# EAGLE schematic cyclops_r2b (EAGLE 6.4)

## Sheet 1 of 3
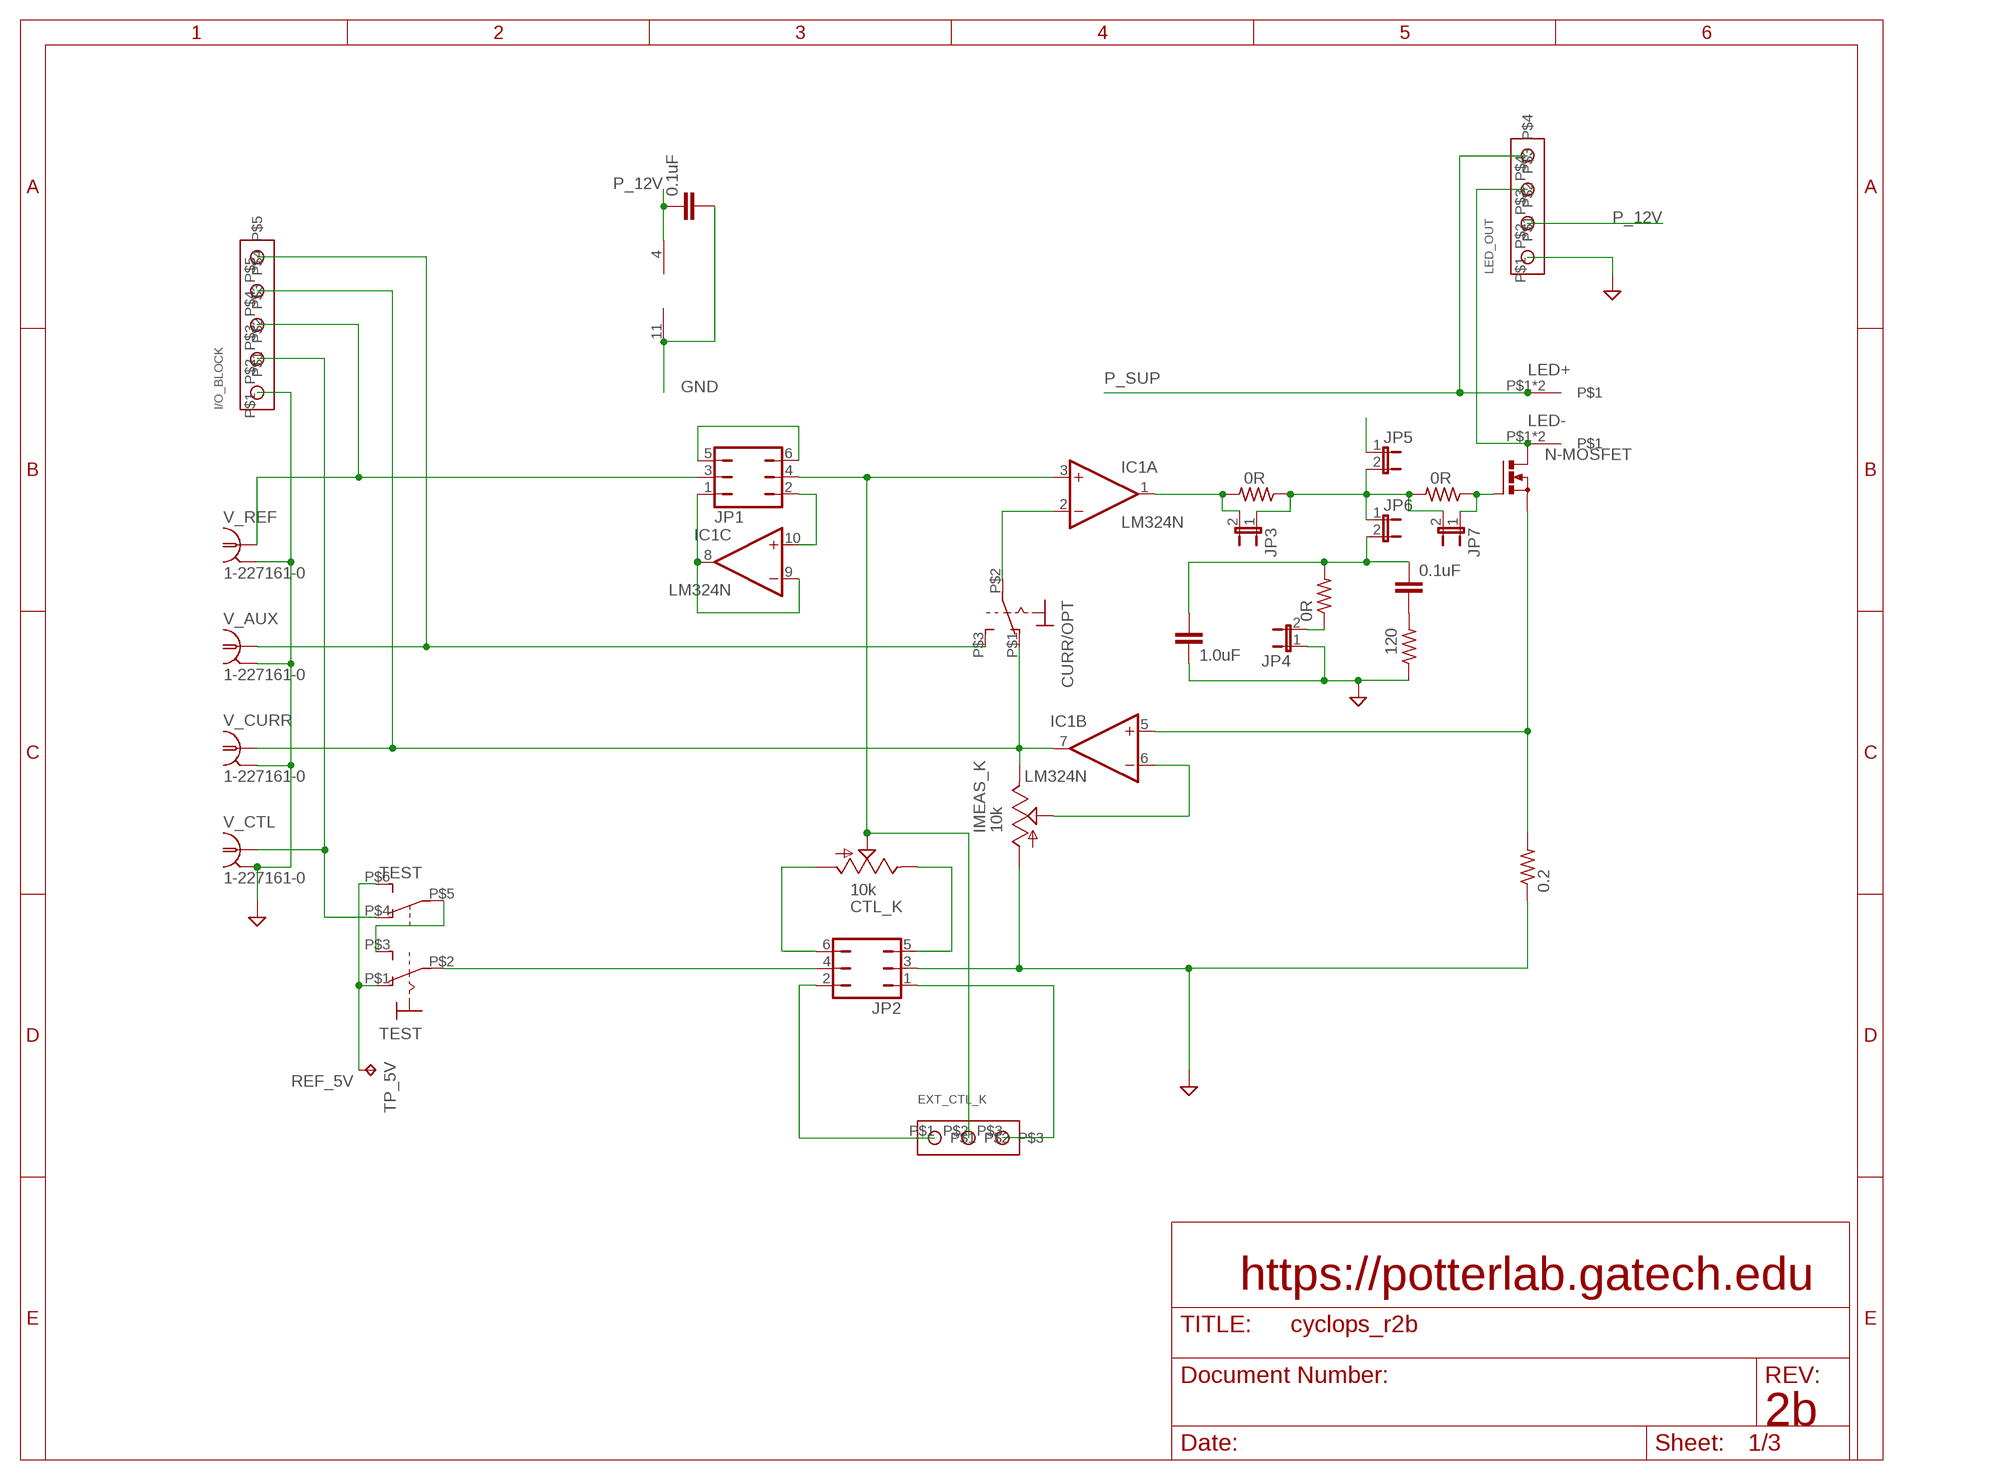
[diagram p0: schematic, sheet 1]

### Parts
C1  0.1uF  C-EU050-024X044  [C050-024X044]
C2  1.0uF  C-EU025-024X044  [C025-024X044]
C3  0.1uF  C-EU050-024X044  [C050-024X044]
CTL_K  10k  TRIM_US-RJ6S  [RJ6S]
CURR/OPT  SPST_SWITCH  [A_TOGGLE_SPST]
EXT_CTL_K  SCREW3  [SCREW3]
I/O_BLOCK  SCREW5  [SCREW5]
IC1  LM324N  [DIL14]
IMEAS_K  10k  TRIM_US-RJ6S  [RJ6S]
JP1  JP3Q  [JP3Q]
JP2  JP3Q  [JP3Q]
JP3  JP1E  [JP1]
JP4  JP1E  [JP1]
JP5  JP1E  [JP1]
JP6  JP1E  [JP1]
JP7  JP1E  [JP1]
LED+  BANANA_TO_BOARD  [BANANA_TO_BOARD]
LED-  BANANA_TO_BOARD  [BANANA_TO_BOARD]
LED_OUT  SCREW4  [SCREW4]
N-MOSFET  PMOSFET_NTO220BH  [TO220BH]
R1  0R  R-US_0207/7  [0207/7]
R2  0R  R-US_0207/7  [0207/7]
R3  120  R-US_0207/7  [0207/7]
R4  0R  R-US_0207/7  [0207/7]
R_CURR  0.2  R-US_0617/22  [IMEAS_R]
TEST  SP3T_SWITCH  [320-938]
TP_5V  TPPAD1-13  [P1-13]
V_AUX  1-227161-0  [AMP_227161]
V_CTL  1-227161-0  [AMP_227161]
V_CURR  1-227161-0  [AMP_227161]
V_REF  1-227161-0  [AMP_227161]

### Nets
GND: C1.2 C2.2 I/O_BLOCK.P$1 IC1.11(P:V-) IMEAS_K.A JP2.3 JP4.1 LED_OUT.P$1 R3.1 R_CURR.1 V_AUX.2(GND) V_CTL.2(GND) V_CURR.2(GND) V_REF.2(GND) ; also sheet 2,3
N$1: CURR/OPT.P$2(P) IC1.2(A:-IN)
N$2: IC1.5(B:+IN) N-MOSFET.S R_CURR.2
N$3: IC1.1(A:OUT) JP3.2 R1.2
N$4: CURR/OPT.P$1(O) I/O_BLOCK.P$4 IC1.7(B:OUT) IMEAS_K.E V_CURR.1
N$5: CURR/OPT.P$3(S) I/O_BLOCK.P$5 V_AUX.1
N$6: JP2.4 TEST.P$2(1:P)
N$7: CTL_K.E JP2.5
N$8: CTL_K.S EXT_CTL_K.P$2 IC1.3(A:+IN) JP1.4
N$9: IC1.8(C:OUT) IC1.9(C:-IN) JP1.1
N$10: I/O_BLOCK.P$2 TEST.P$4(B:O) V_CTL.1
N$11: C2.1 C3.1 JP6.2 R2.2
N$12: CTL_K.A JP2.6
N$13: C3.2 R3.2
N$14: IC1.10(C:+IN) JP1.2
N$15: IC1.6(B:-IN) IMEAS_K.S
N$17: JP1.5 JP1.6
N$18: I/O_BLOCK.P$3 JP1.3 V_REF.1
N$21: LED-.P$1 LED-.P$2 LED_OUT.P$3 N-MOSFET.D
N$23: TEST.P$3(1:S) TEST.P$5(B:P)
N$25: EXT_CTL_K.P$1 JP2.2
N$26: EXT_CTL_K.P$3 JP2.1
N$27: JP4.2 R2.1
N$29: JP3.1 JP5.2 JP6.1 JP7.2 R1.1 R4.2
N$30: JP7.1 N-MOSFET.G R4.1
N$69: JP5.1
P_12V: C1.1 IC1.4(P:V+) LED_OUT.P$2 ; also sheet 2
P_SUP: LED+.P$1 LED+.P$2 LED_OUT.P$4 ; also sheet 2,3
REF_5V: TEST.P$1(1:O) TEST.P$6(B:S) TP_5V.TP ; also sheet 2
Unconnected: IC1.12(D:+IN) IC1.13(D:-IN) IC1.14(D:OUT)

### Notes on the sheet
- https://potterlab.gatech.edu
- 2b

## Sheet 2 of 3
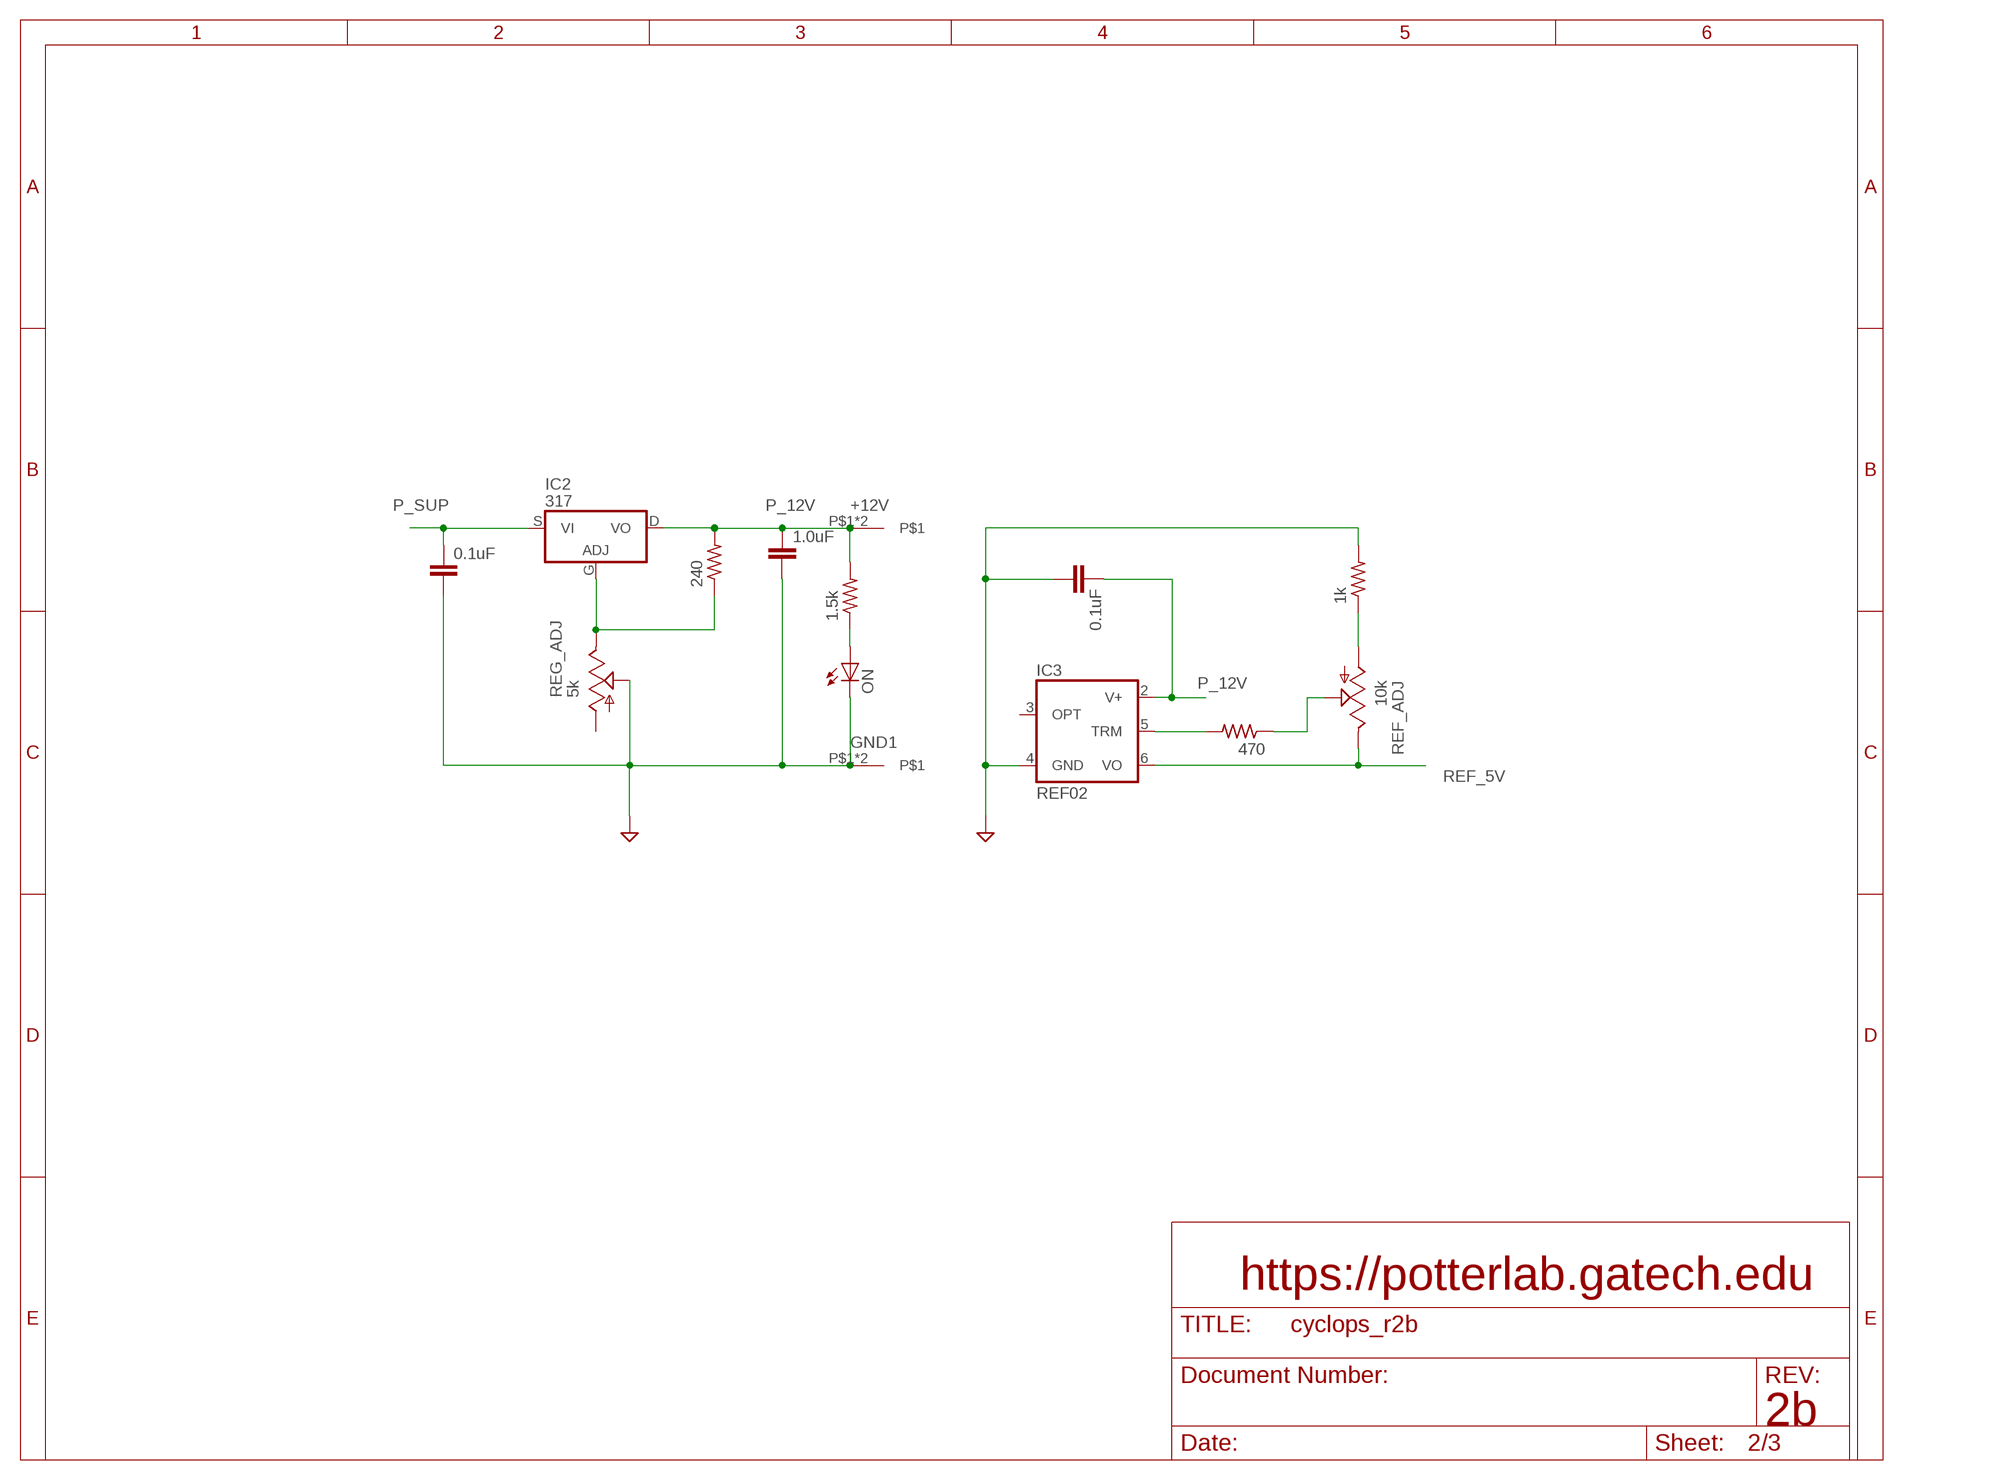
[diagram p1: schematic, sheet 2]

### Parts
+12V  BANANA_TO_BOARD  [BANANA_TO_BOARD]
C4  0.1uF  C-EU050-024X044  [C050-024X044]
C5  1.0uF  C-EU025-024X044  [C025-024X044]
C6  0.1uF  C-EU050-024X044  [C050-024X044]
GND1  BANANA_TO_BOARD  [BANANA_TO_BOARD]
IC2  317  [TO220BH]
IC3  REF02  REF02DIL08-LONG  [DIL08-OVAL]
ON  LED3MM  [LED3MM]
R5  240  R-US_0207/7  [0207/7]
R6  1.5k  R-US_0207/7  [0207/7]
R7  470  R-US_0207/7  [0207/7]
R8  1k  R-US_0207/7  [0207/7]
REF_ADJ  10k  TRIM_US-RJ6S  [RJ6S]
REG_ADJ  5k  TRIM_US-RJ6S  [RJ6S]

### Nets
GND: C4.2 C5.2 C6.2 GND1.P$1 GND1.P$2 IC3.4(GND) ON.K(C) R8.2 REG_ADJ.S ; also sheet 1,3
N$19: IC2.G(ADJ) R5.1 REG_ADJ.E
N$20: IC3.5(TRM) R7.2
N$22: R7.1 REF_ADJ.S
N$24: R8.1 REF_ADJ.A
N$28: ON.A R6.1
P_12V: +12V.P$1 +12V.P$2 C5.1 C6.1 IC2.D(VO) IC3.2(V+) R5.2 R6.2 ; also sheet 1
P_SUP: C4.1 IC2.S(VI) ; also sheet 1,3
REF_5V: IC3.6(VO) REF_ADJ.E ; also sheet 1
Unconnected: IC3.3(OPT) REG_ADJ.A

### Notes on the sheet
- https://potterlab.gatech.edu
- 2b

## Sheet 3 of 3
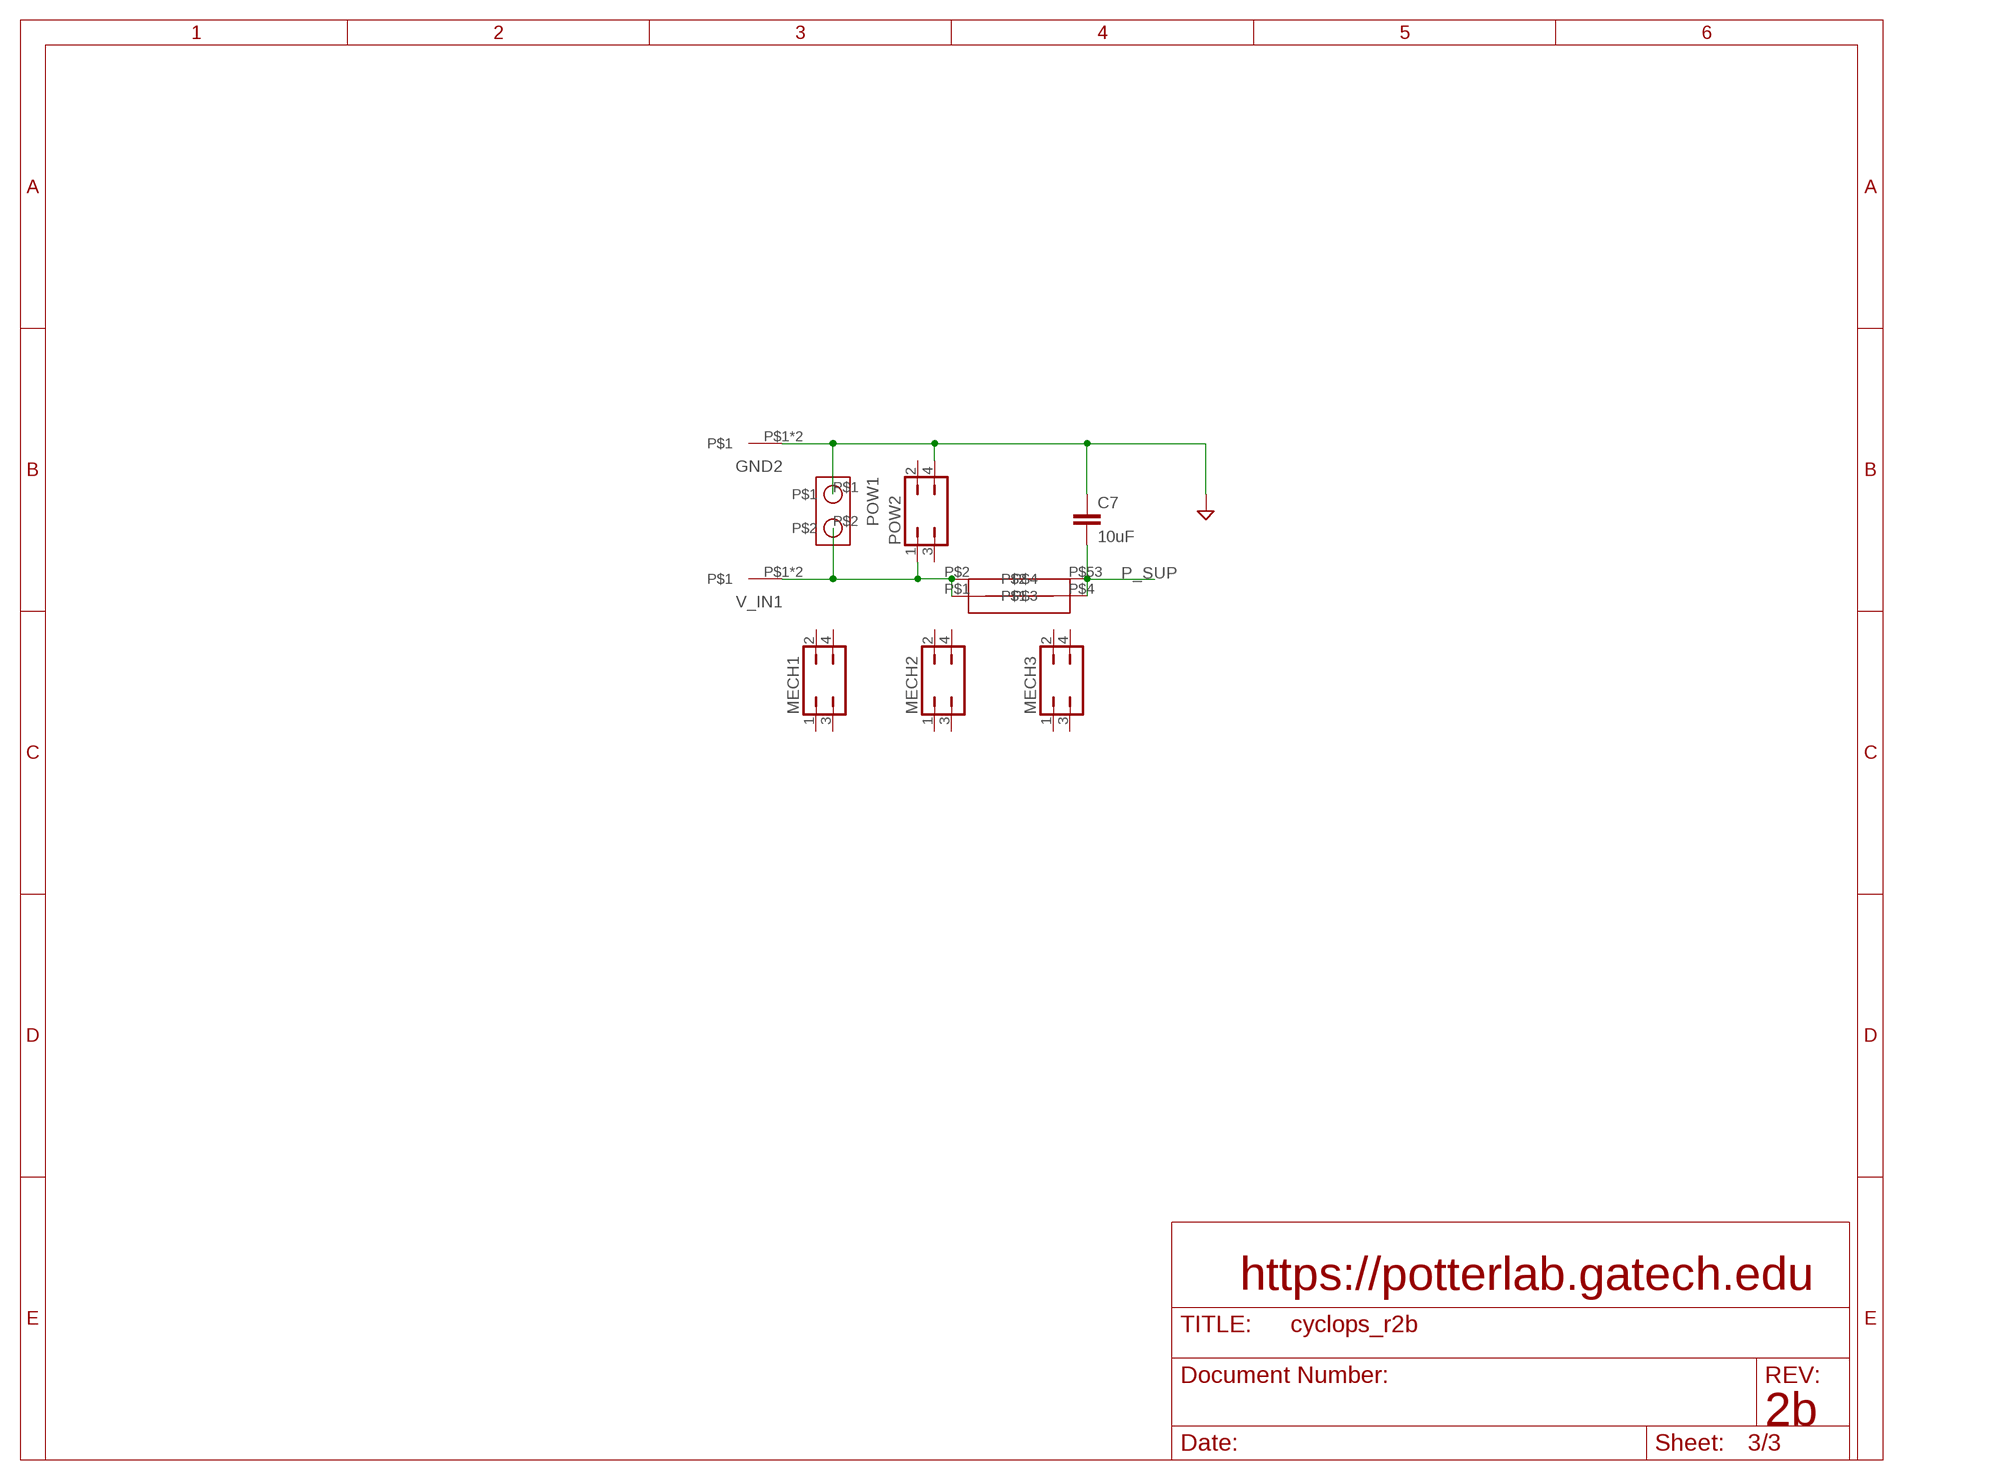
[diagram p2: schematic, sheet 3]

### Parts
C7  10uF  C-EU025-024X044  [C025-024X044]
GND2  BANANA_TO_BOARD  [BANANA_TO_BOARD]
MECH1  JP2Q  [JP2Q]
MECH2  JP2Q  [JP2Q]
MECH3  JP2Q  [JP2Q]
POW1  SCREW2  [SCREW2]
POW2  JP2Q  [JP2Q]
U$1  FUSE >2A  NXT-FUSE  [NXT-FUSE]
V_IN1  BANANA_TO_BOARD  [BANANA_TO_BOARD]

### Nets
GND: C7.1 GND2.P$1 GND2.P$2 POW1.P$1 POW2.4 ; also sheet 1,2
P_SUP: C7.2 U$1.P$4 U$1.P$53 ; also sheet 1,2
P_SUP_BEFORE: POW1.P$2 POW2.1 U$1.P$1 U$1.P$2 V_IN1.P$1 V_IN1.P$2
Unconnected: MECH1.1 MECH1.2 MECH1.3 MECH1.4 MECH2.1 MECH2.2 MECH2.3 MECH2.4 MECH3.1 MECH3.2 MECH3.3 MECH3.4 POW2.2 POW2.3

### Notes on the sheet
- https://potterlab.gatech.edu
- 2b

## Library data of the parts
+12V GND1 GND2 LED+ LED- V_IN1 = cyclops:BANANA_TO_BOARD: Female banana socket to board, right angle. Digikey part: J111-ND (or similar).
C1-C7 = rcl:C-EU: CAPACITOR, European symbol
CTL_K IMEAS_K REF_ADJ REG_ADJ = cyclops:TRIM_US-: POTENTIOMETER
CURR/OPT = HOSS:SPST_SWITCH: TOGGLE SWITCH distributor RS Components
EXT_CTL_K = HOSS:SCREW3
I/O_BLOCK = HOSS:SCREW5
IC1 = linear:LM324: OP AMP
IC2 = HOSS:*317: Positive VOLTAGE REGULATOR
IC3 = linear:REF02: VOLTAGE REFERENCE
JP1 JP2 = jumper:JP3Q: JUMPER
JP3-JP7 = jumper:JP1E: JUMPER
LED_OUT = HOSS:SCREW4
MECH1-MECH3 POW2 = jumper:JP2Q: JUMPER
N-MOSFET = transistor-power:PMOSFET_N: Power MOSFET N-Channel
ON = led:LED: LED OSRAM: - CHIPLED LG R971, LG N971, LY N971, LG Q971, LY Q971, LO R971, LY R971 LH N974, LH R974 LS Q976, LO Q976, LY Q976 LO Q996 - Hyper CHIPLED LW Q18S LB Q993, LB Q99A, LB R99A - SideLED LS A670, LO A670, LY A670, LG A670, LP A670 LB A673, LV A673, LT A673, LW A673 LH A674 LY A675 LS A676, LA A676, LO A676, LY A676, LW A676 LS A679, LY A679, LG A679 - Hyper Micro SIDELED® LS Y876, LA Y876, LO Y876, LY Y876 LT Y87S - SmartLED LW L88C, LW L88S LB L89C, LB L89S, LG L890 LS L89K, LO L89K, LY L89K LS L896, LA L896, LO L896, LY L896 - TOPLED LS T670, LO T670, LY T670, LG T670, LP T670 LSG T670, LSP T670, LSY T670, LOP T670, LYG T670 LG T671, LOG T671, LSG T671 LB T673, LV T673, LT T673, LW T673 LH T674 LS T676, LA T676, LO T676, LY T676, LB T676, LH T676, LSB T676, LW T676 LB T67C, LV T67C, LT T67C, LS T67K, LO T67K, LY T67K, LW E67C LS E67B, LA E67B, LO E67B, LY E67B, LB E67C, LV E67C, LT E67C LW T67C LS T679, LY T679, LG T679 LS T770, LO T770, LY T770, LG T770, LP T770 LB T773, LV T773, LT T773, LW T773 LH T774 LS E675, LA E675, LY E675, LS T675 LS T776, LA T776, LO T776, LY T776, LB T776 LHGB T686 LT T68C, LB T68C - Hyper Mini TOPLED® LB M676 - Mini TOPLED Santana® LG M470 LS M47K, LO M47K, LY M47K Source: http://www.osram.convergy.de LUXEON: - LUMILED® LXK2-PW12-R00, LXK2-PW12-S00, LXK2-PW14-U00, LXK2-PW14-V00 LXK2-PM12-R00, LXK2-PM12-S00, LXK2-PM14-U00 LXK2-PE12-Q00, LXK2-PE12-R00, LXK2-PE12-S00, LXK2-PE14-T00, LXK2-PE14-U00 LXK2-PB12-K00, LXK2-PB12-L00, LXK2-PB12-M00, LXK2-PB14-N00, LXK2-PB14-P00, LXK2-PB14-Q00 LXK2-PR12-L00, LXK2-PR12-M00, LXK2-PR14-Q00, LXK2-PR14-R00 LXK2-PD12-Q00, LXK2-PD12-R00, LXK2-PD12-S00 LXK2-PH12-R00, LXK2-PH12-S00 LXK2-PL12-P00, LXK2-PL12-Q00, LXK2-PL12-R00 Source: www.luxeon.com KINGBRIGHT: KA-3528ASYC Source: www.kingbright.com
POW1 = HOSS:SCREW2
R1-R8 = HOSS:R-US_: RESISTOR, American symbol
R_CURR = cyclops:R-US_: RESISTOR, American symbol
TEST = HOSS:SP3T_SWITCH: TOGGLE SWITCH distributor RS Components
TP_5V = testpad:TP: Test pad
U$1 = cyclops:NXT-FUSE
V_AUX V_CTL V_CURR V_REF = cyclops:?227161*: JACK, RIGHT ANGLE, 50 OHM, PCB, BNC Source: amp_227161.pdf